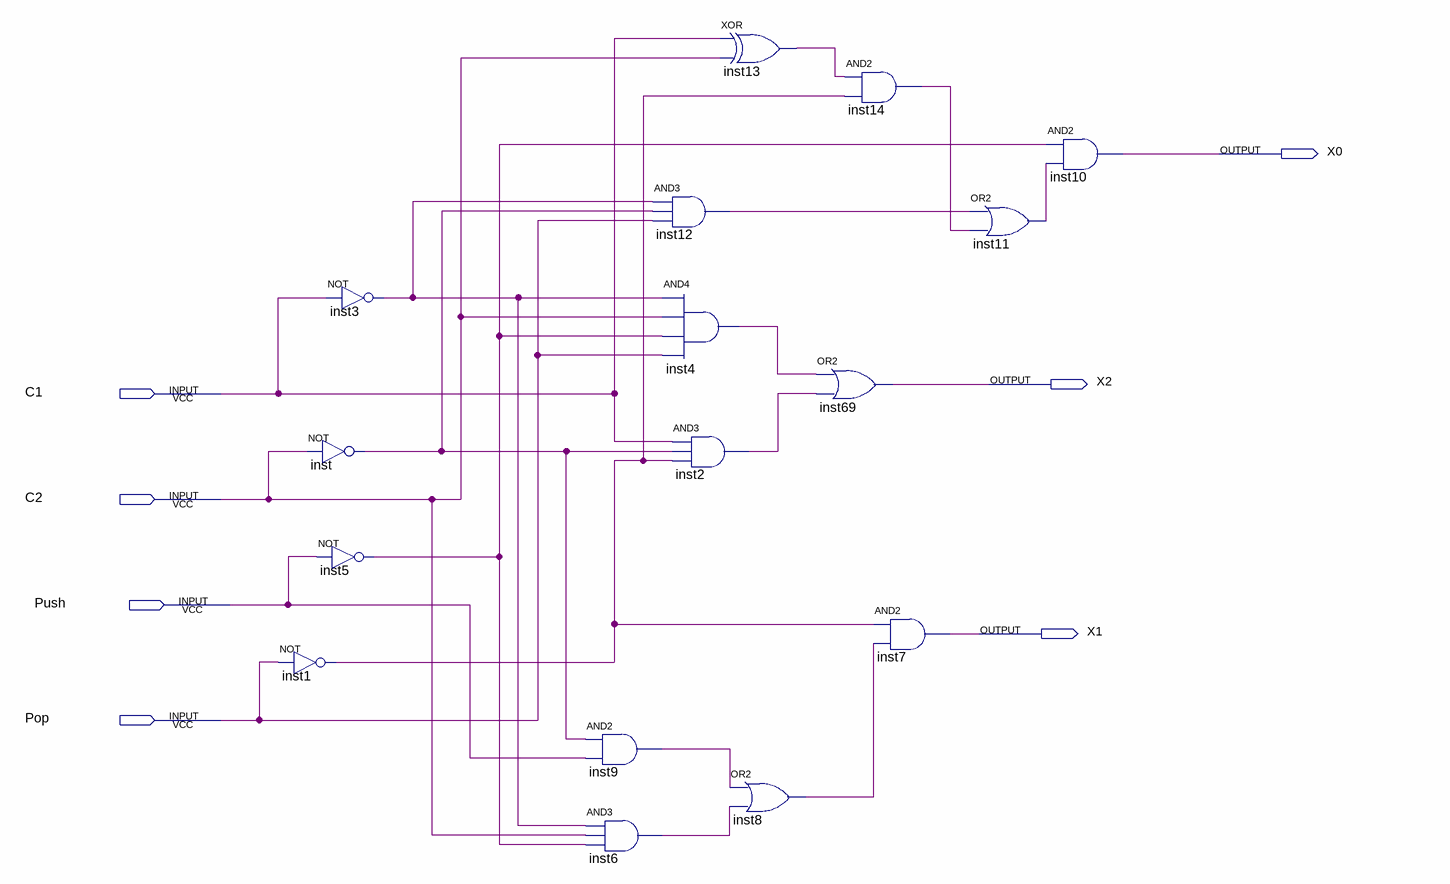
[diagram p0: schematic sheet]
// Quartus schematic CodificadorMaquinaDeEstados.bdf as structural Verilog: 16 symbols, 7 pins
module CodificadorMaquinaDeEstados (
  input  C1,
  input  C2,
  input  Push,
  input  Pop,
  output X0,
  output X2,
  output X1
);

  wire inst1_out, inst2_out, inst3_out, inst4_out, inst5_out, inst6_out, inst8_out, inst9_out, inst11_out,
       inst12_out, inst13_out, inst14_out, inst_out;

  not inst1 (inst1_out, Pop);
  not inst3 (inst3_out, C1);
  not inst (inst_out, C2);
  not inst5 (inst5_out, Push);
  and inst9 (inst9_out, inst_out, Push);
  and inst6 (inst6_out, inst3_out, C2, inst5_out);
  and inst12 (inst12_out, inst3_out, inst_out, Pop);
  and inst4 (inst4_out, inst3_out, C2, inst5_out, Pop);
  xor inst13 (inst13_out, C1, C2);
  and inst2 (inst2_out, C1, inst_out, inst1_out);
  or inst8 (inst8_out, inst9_out, inst6_out);
  or inst69 (X2, inst4_out, inst2_out);
  and inst14 (inst14_out, inst13_out, inst1_out);
  and inst7 (X1, inst1_out, inst8_out);
  or inst11 (inst11_out, inst12_out, inst14_out);
  and inst10 (X0, inst5_out, inst11_out);
endmodule
